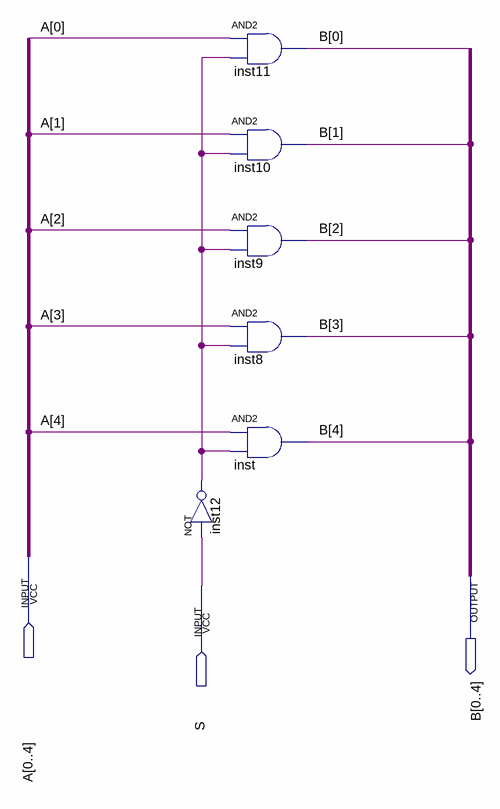
[diagram p0: schematic sheet]
// Quartus schematic muxS.bdf as structural Verilog: 6 symbols, 3 pins
module muxS (
  input  [0:4] A,
  input  S,
  output [0:4] B
);

  wire inst12_out;

  not inst12 (inst12_out, S);
  and inst11 (B[0], A[0], inst12_out);
  and inst10 (B[1], A[1], inst12_out);
  and inst9 (B[2], A[2], inst12_out);
  and inst8 (B[3], A[3], inst12_out);
  and inst (B[4], A[4], inst12_out);
endmodule
